# Altium project SiC780驱动.PrjPCB
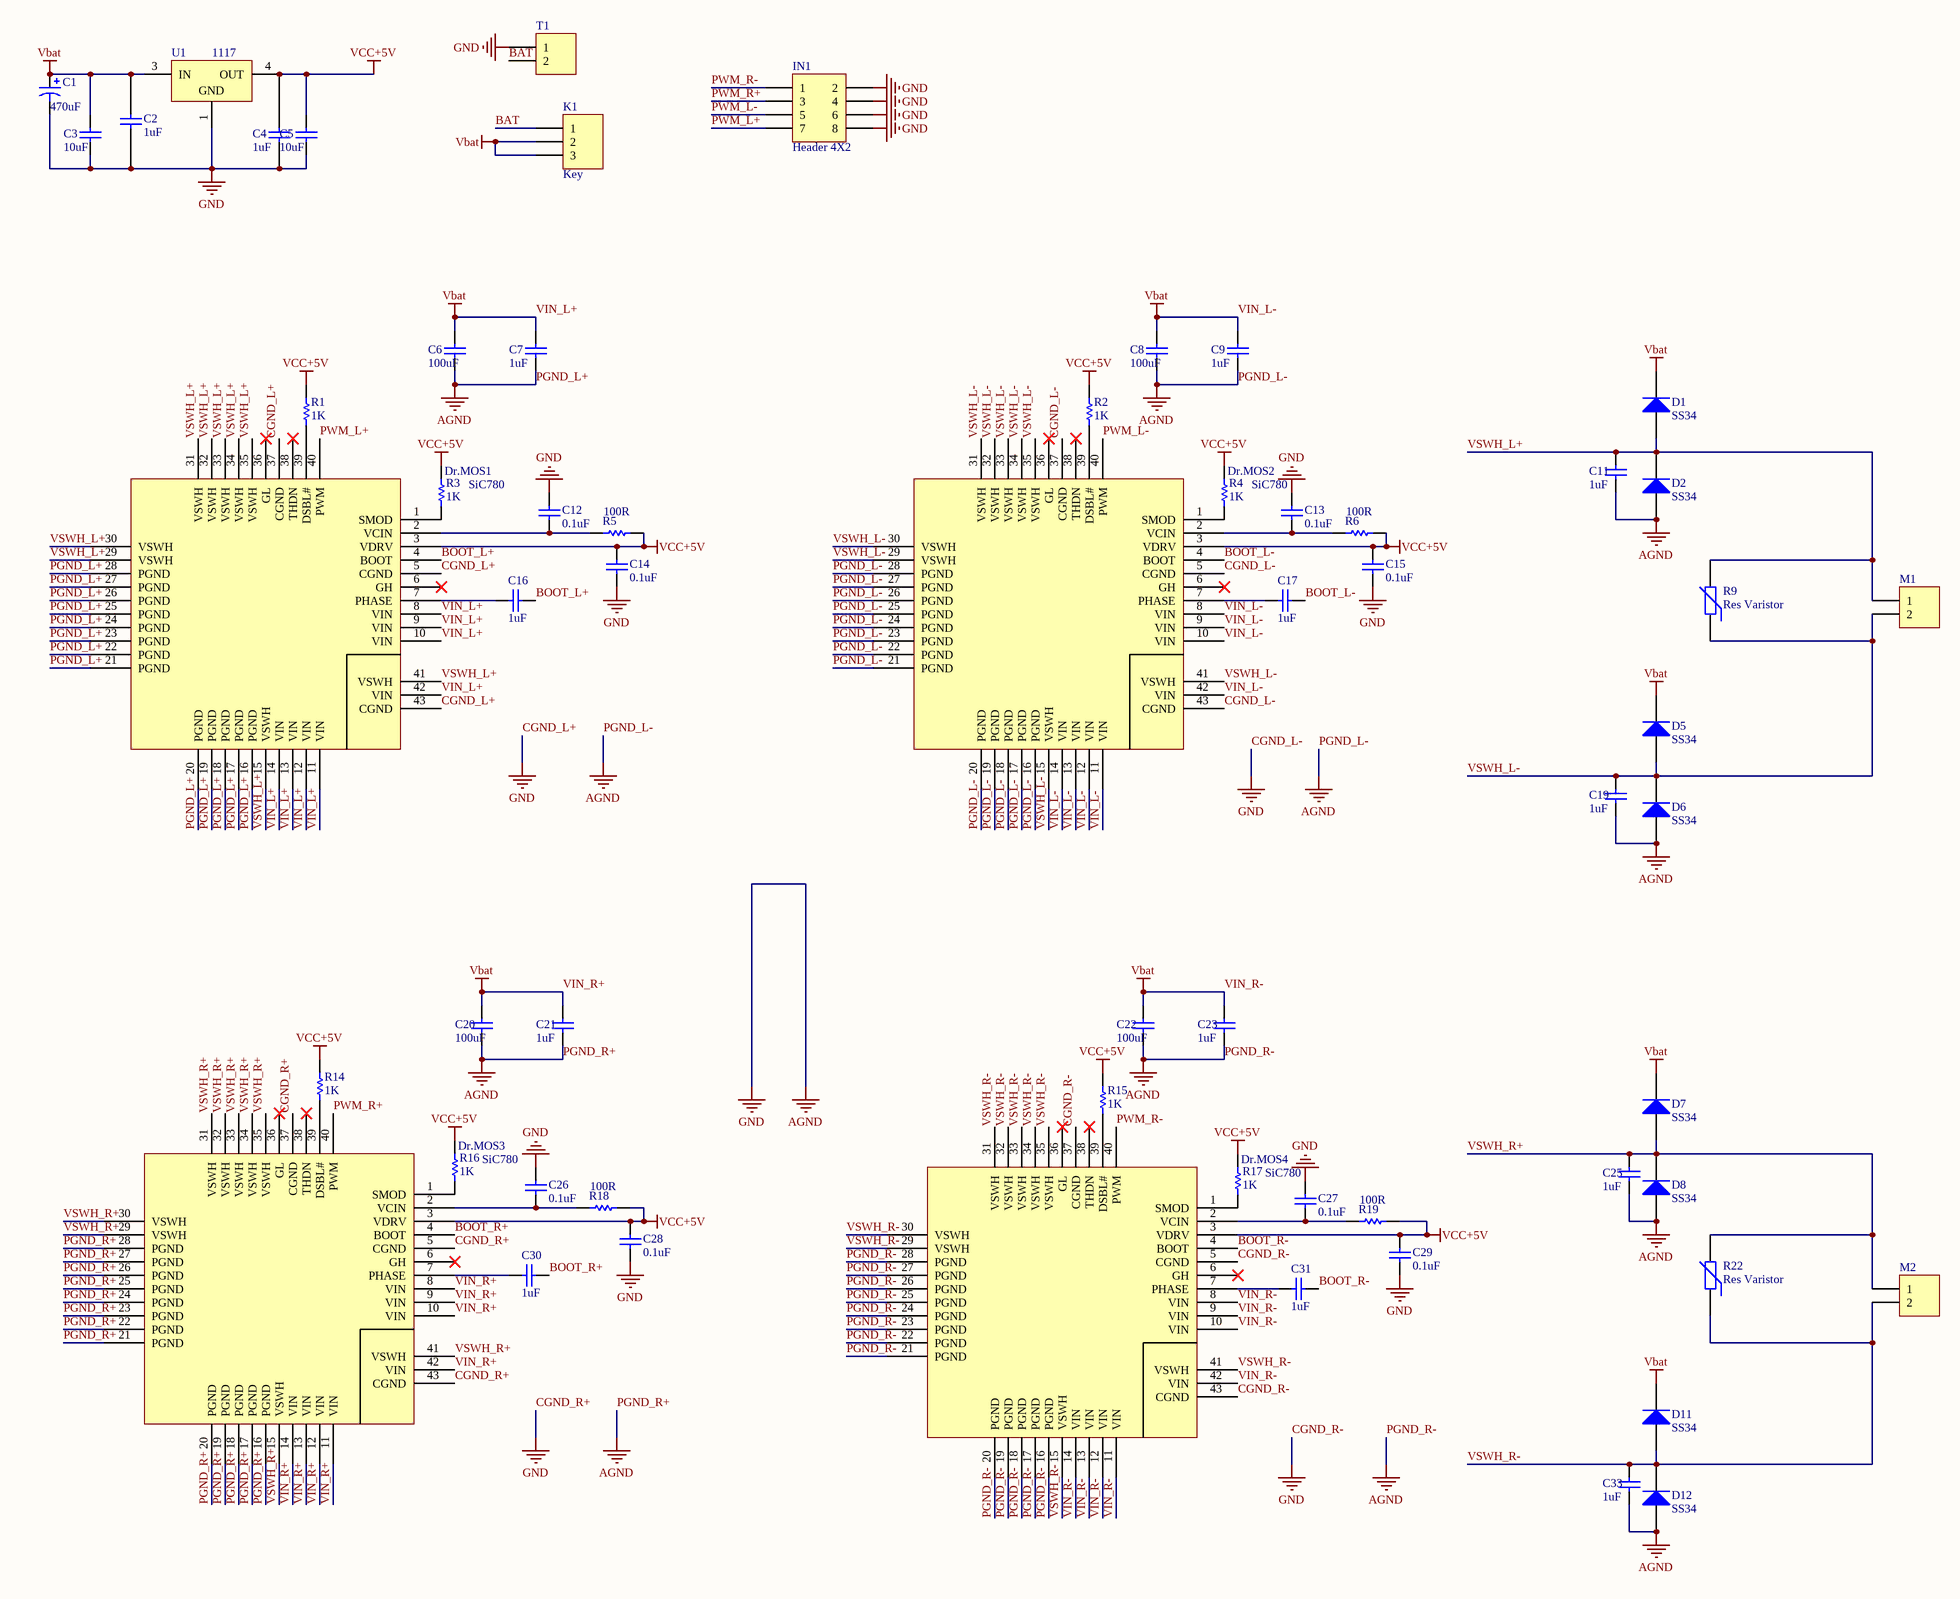
[diagram p0: SiC780驱动.SchDoc]
1 sheet, 61 parts. Net scope: global (net labels, ports and power ports of the same name join across sheets).
Board file: SiC780驱动.PcbDoc

## Sheet SiC780驱动.SchDoc
size A2; Organization: Altium Limited; Address1: L3, 12a Rodborough Rd; Address2: Frenchs Forest; Address3: NSW; Address4: Australia 2086

### Parts
C1  470uf  [CAP]
C2  1uF  [0603_C]
C3  10uF  [1206_C]
C4  1uF  [0603_C]
C5  10uF  [1206_C]
C6  100uF  [1206_C]
C7  1uF  [0603_C]
C8  100uF  [1206_C]
C9  1uF  [0603_C]
C11  1uF  [0603_C]
C12  0.1uF  [0603_C]
C13  0.1uF  [0603_C]
C14  0.1uF  [0603_C]
C15  0.1uF  [0603_C]
C16  value 1uF  [0603_C]  (hidden comment: 0.1uF)
C17  value 1uF  [0603_C]  (hidden comment: 0.1uF)
C19  1uF  [0603_C]
C20  100uF  [1206_C]
C21  1uF  [0603_C]
C22  100uF  [1206_C]
C23  1uF  [0603_C]
C25  1uF  [0603_C]
C26  0.1uF  [0603_C]
C27  0.1uF  [0603_C]
C28  0.1uF  [0603_C]
C29  0.1uF  [0603_C]
C30  value 1uF  [0603_C]  (hidden comment: 0.1uF)
C31  value 1uF  [0603_C]  (hidden comment: 0.1uF)
C33  1uF  [0603_C]
D1  SS34  [Diode-1N5189  5*1.5mm]
D2  SS34  [Diode-1N5189  5*1.5mm]
D5  SS34  [Diode-1N5189  5*1.5mm]
D6  SS34  [Diode-1N5189  5*1.5mm]
D7  SS34  [Diode-1N5189  5*1.5mm]
D8  SS34  [Diode-1N5189  5*1.5mm]
D11  SS34  [Diode-1N5189  5*1.5mm]
D12  SS34  [Diode-1N5189  5*1.5mm]
Dr.MOS1  SiC780  [SiC780_new]
Dr.MOS2  SiC780  [SiC780_new]
Dr.MOS3  SiC780  [SiC780_new]
Dr.MOS4  SiC780  [SiC780_new]
IN1  Header 4X2  [HDR2X4_3D]
K1  Key  [SW-M]
M1  (no value)  [KF301-2P]
M2  (no value)  [KF301-2P]
R1  1K  [R0603]
R2  1K  [R0603]
R3  1K  [R0603]
R4  1K  [R0603]
R5  100R  [R0603]
R6  100R  [R0603]
R9  Res Varistor  [6-0805_N]
R14  1K  [R0603]
R15  1K  [R0603]
R16  1K  [R0603]
R17  1K  [R0603]
R18  100R  [R0603]
R19  100R  [R0603]
R22  Res Varistor  [6-0805_N]
T1  (no value)  [KF301-2P]
U1  1117  [SOT223_N]

### Nets
CGND_L+: C1.2 C2.1 C3.2 C4.2 C5.2 C6.2 C7.2 C8.2 C9.2 C11.2 C12.1 C13.1 C14.1 C15.1 C19.2 C20.2 C21.2 C22.2 C23.2 C25.2 C26.1 C27.1 C28.1 C29.1 C33.2 D2.1(A) D6.1(A) D8.1(A) D12.1(A) Dr.MOS1.5(CGND) Dr.MOS1.16(PGND) Dr.MOS1.17(PGND) Dr.MOS1.18(PGND) Dr.MOS1.19(PGND) Dr.MOS1.20(PGND) Dr.MOS1.21(PGND) Dr.MOS1.22(PGND) Dr.MOS1.23(PGND) Dr.MOS1.24(PGND) Dr.MOS1.25(PGND) Dr.MOS1.26(PGND) Dr.MOS1.27(PGND) Dr.MOS1.28(PGND) Dr.MOS1.37(CGND) Dr.MOS1.43(CGND) Dr.MOS2.5(CGND) Dr.MOS2.16(PGND) Dr.MOS2.17(PGND) Dr.MOS2.18(PGND) Dr.MOS2.19(PGND) Dr.MOS2.20(PGND) Dr.MOS2.21(PGND) Dr.MOS2.22(PGND) Dr.MOS2.23(PGND) Dr.MOS2.24(PGND) Dr.MOS2.25(PGND) Dr.MOS2.26(PGND) Dr.MOS2.27(PGND) Dr.MOS2.28(PGND) Dr.MOS2.37(CGND) Dr.MOS2.43(CGND) Dr.MOS3.5(CGND) Dr.MOS3.16(PGND) Dr.MOS3.17(PGND) Dr.MOS3.18(PGND) Dr.MOS3.19(PGND) Dr.MOS3.20(PGND) Dr.MOS3.21(PGND) Dr.MOS3.22(PGND) Dr.MOS3.23(PGND) Dr.MOS3.24(PGND) Dr.MOS3.25(PGND) Dr.MOS3.26(PGND) Dr.MOS3.27(PGND) Dr.MOS3.28(PGND) Dr.MOS3.37(CGND) Dr.MOS3.43(CGND) Dr.MOS4.5(CGND) Dr.MOS4.16(PGND) Dr.MOS4.17(PGND) Dr.MOS4.18(PGND) Dr.MOS4.19(PGND) Dr.MOS4.20(PGND) Dr.MOS4.21(PGND) Dr.MOS4.22(PGND) Dr.MOS4.23(PGND) Dr.MOS4.24(PGND) Dr.MOS4.25(PGND) Dr.MOS4.26(PGND) Dr.MOS4.27(PGND) Dr.MOS4.28(PGND) Dr.MOS4.37(CGND) Dr.MOS4.43(CGND) IN1.2 IN1.4 IN1.6 IN1.8 T1.1 U1.1(GND)  [also labelled AGND, CGND_L-, CGND_R+, CGND_R-, GND, PGND_L+, PGND_L-, PGND_R+, PGND_R-]
VCC+5V: C4.1 C5.1 C14.2 C15.2 C28.2 C29.2 Dr.MOS1.3(VDRV) Dr.MOS2.3(VDRV) Dr.MOS3.3(VDRV) Dr.MOS4.3(VDRV) R1.1 R2.1 R3.1 R4.1 R5.1 R6.1 R14.1 R15.1 R16.1 R17.1 R18.1 R19.1 U1.4(OUT)
VIN_L+: C1.1 C2.2 C3.1 C6.1 C7.1 C8.1 C9.1 C20.1 C21.1 C22.1 C23.1 D1.2(K) D5.2(K) D7.2(K) D11.2(K) Dr.MOS1.8(VIN) Dr.MOS1.9(VIN) Dr.MOS1.10(VIN) Dr.MOS1.11(VIN) Dr.MOS1.12(VIN) Dr.MOS1.13(VIN) Dr.MOS1.14(VIN) Dr.MOS1.42(VIN) Dr.MOS2.8(VIN) Dr.MOS2.9(VIN) Dr.MOS2.10(VIN) Dr.MOS2.11(VIN) Dr.MOS2.12(VIN) Dr.MOS2.13(VIN) Dr.MOS2.14(VIN) Dr.MOS2.42(VIN) Dr.MOS3.8(VIN) Dr.MOS3.9(VIN) Dr.MOS3.10(VIN) Dr.MOS3.11(VIN) Dr.MOS3.12(VIN) Dr.MOS3.13(VIN) Dr.MOS3.14(VIN) Dr.MOS3.42(VIN) Dr.MOS4.8(VIN) Dr.MOS4.9(VIN) Dr.MOS4.10(VIN) Dr.MOS4.11(VIN) Dr.MOS4.12(VIN) Dr.MOS4.13(VIN) Dr.MOS4.14(VIN) Dr.MOS4.42(VIN) K1.2 K1.3 U1.3(IN)  [also labelled Vbat, VIN_L-, VIN_R+, VIN_R-]
BAT: K1.1 T1.2
BOOT_L+: C16.2 Dr.MOS1.4(BOOT)
BOOT_L-: C17.2 Dr.MOS2.4(BOOT)
BOOT_R+: C30.2 Dr.MOS3.4(BOOT)
BOOT_R-: C31.2 Dr.MOS4.4(BOOT)
PWM_L+: Dr.MOS1.40(PWM) IN1.7
PWM_L-: Dr.MOS2.40(PWM) IN1.5
PWM_R+: Dr.MOS3.40(PWM) IN1.3
PWM_R-: Dr.MOS4.40(PWM) IN1.1
VSWH_L+: C11.1 D1.1(A) D2.2(K) Dr.MOS1.15(VSWH) Dr.MOS1.29(VSWH) Dr.MOS1.30(VSWH) Dr.MOS1.31(VSWH) Dr.MOS1.32(VSWH) Dr.MOS1.33(VSWH) Dr.MOS1.34(VSWH) Dr.MOS1.35(VSWH) Dr.MOS1.41(VSWH) M1.1 R9.2
VSWH_L-: C19.1 D5.1(A) D6.2(K) Dr.MOS2.15(VSWH) Dr.MOS2.29(VSWH) Dr.MOS2.30(VSWH) Dr.MOS2.31(VSWH) Dr.MOS2.32(VSWH) Dr.MOS2.33(VSWH) Dr.MOS2.34(VSWH) Dr.MOS2.35(VSWH) Dr.MOS2.41(VSWH) M1.2 R9.1
VSWH_R+: C25.1 D7.1(A) D8.2(K) Dr.MOS3.15(VSWH) Dr.MOS3.29(VSWH) Dr.MOS3.30(VSWH) Dr.MOS3.31(VSWH) Dr.MOS3.32(VSWH) Dr.MOS3.33(VSWH) Dr.MOS3.34(VSWH) Dr.MOS3.35(VSWH) Dr.MOS3.41(VSWH) M2.1 R22.2
VSWH_R-: C33.1 D11.1(A) D12.2(K) Dr.MOS4.15(VSWH) Dr.MOS4.29(VSWH) Dr.MOS4.30(VSWH) Dr.MOS4.31(VSWH) Dr.MOS4.32(VSWH) Dr.MOS4.33(VSWH) Dr.MOS4.34(VSWH) Dr.MOS4.35(VSWH) Dr.MOS4.41(VSWH) M2.2 R22.1
NetC12_2: C12.2 Dr.MOS1.2(VCIN) R5.2
NetC13_2: C13.2 Dr.MOS2.2(VCIN) R6.2
NetC16_1: C16.1 Dr.MOS1.7(PHASE)
NetC17_1: C17.1 Dr.MOS2.7(PHASE)
NetC26_2: C26.2 Dr.MOS3.2(VCIN) R18.2
NetC27_2: C27.2 Dr.MOS4.2(VCIN) R19.2
NetC30_1: C30.1 Dr.MOS3.7(PHASE)
NetC31_1: C31.1 Dr.MOS4.7(PHASE)
NetDr.MOS1_1: Dr.MOS1.1(SMOD) R3.2
NetDr.MOS1_39: Dr.MOS1.39(DSBL#) R1.2
NetDr.MOS2_1: Dr.MOS2.1(SMOD) R4.2
NetDr.MOS2_39: Dr.MOS2.39(DSBL#) R2.2
NetDr.MOS3_1: Dr.MOS3.1(SMOD) R16.2
NetDr.MOS3_39: Dr.MOS3.39(DSBL#) R14.2
NetDr.MOS4_1: Dr.MOS4.1(SMOD) R17.2
NetDr.MOS4_39: Dr.MOS4.39(DSBL#) R15.2

Not connected (* = marked no-connect by the designer): Dr.MOS1 6(GH)* 36(GL)* 38(THDN)*; Dr.MOS2 6(GH)* 36(GL)* 38(THDN)*; Dr.MOS3 6(GH)* 36(GL)* 38(THDN)*; Dr.MOS4 6(GH)* 36(GL)* 38(THDN)*

### Notes on the sheet
- Title
- Size:
- Date:
- A3
- Number:
- Time:
- Revision:
- Sheet
- of
- File:

### Library data of the parts
C1 = Cap Pol3: Polarized Capacitor (Surface Mount); Published: 8-Jun-2000; LatestRevisionDate: 17-Jul-2002; LatestRevisionNote: Re-released for DXP Platform.; PackageReference: C0805; Publisher: Altium Limited; Value: 470uF
C2-C9 C11-C17 C19-C23 C25-C31 C33 = Cap: Capacitor; Published: 8-Jun-2000; LatestRevisionDate: 17-Jul-2002; LatestRevisionNote: Re-released for DXP Platform.; PackageReference: RAD-0.3; Publisher: Altium Limited
  C2 C4 C7 C9 C11 C19 C21 C23 C25 C33: Value: 1uF
  C3 C5: Value: 10uF
  C6 C8 C20 C22: Value: 100uF
  C12-C15 C26-C29: Value: 0.1uF
D1 D2 D5-D8 D11 D12 = Diode
IN1 = Header 4X2: Header, 4-Pin, Dual row; LatestRevisionDate: 17-Jul-2002; LatestRevisionNote: Re-released for DXP Platform.; Publisher: Altium Limited
K1 = Header 3: Header, 3-Pin; LatestRevisionDate: 17-Jul-2002; LatestRevisionNote: Re-released for DXP Platform.; Publisher: Altium Limited
M1 M2 T1 = Header 2: Header, 2-Pin; LatestRevisionDate: 17-Jul-2002; LatestRevisionNote: Re-released for DXP Platform.; Publisher: Altium Limited
R1-R6 R14-R19 = Res1: Resistor; Published: 8-Jun-2000; LatestRevisionDate: 17-Jul-2002; LatestRevisionNote: Re-released for DXP Platform.; Publisher: Altium Limited
  R1-R4 R14-R17: Value: 1K
  R5 R6 R18 R19: Value: 100R
R9 R22 = Res Varistor: Varistor (Voltage-Sensitive Resistor); Published: 24-Mar-1999; LatestRevisionDate: 29-May-2009; LatestRevisionNote: IPC-7351 Footprint Added.; PackageVersion: Mar-2003; PackageReference: 6-0805; Publisher: Altium Limited; PackageDescription: Chip Resistor 0805 Case Size; Code_IPC: RESC2012
U1 = LM1117DT-3.3: 800mA Low-Dropout Linear Regulator; pin to pad: 2>4; Manufacturer: National Semiconductor; CompType: LDO IC; PackageTopMarking: NSUZXYTT*LM1117*DT-3.3; PowerWise: N; Published: 4-Dec-2008; DatasheetVersion: Apr-2006; PackageVersion: revC, Apr-2003; PackageReference: TD03B; Publisher: Altium Limited; PackageDescription: TO252, Molded, Jedec, 6.8 x 6.10 x 2.30mm Body, 3 Lead, 2.28mm Pitch, Surface Mount; PartNumber: LM1117DT-3.3; RoHS: O; PinCount: 3; DigiKeyPartNumber: LM1117DT-3.3-ND; Code_JEDEC: TO-252-AA; ComponentLink1Description: LM1117 Datasheet; ComponentLink1URL: http://www.national.com/ds/LM/LM1117.pdf; ComponentLink2Description: LM1117 Web Page; ComponentLink2URL: http://www.national.com/pf/LM/LM1117.html; ComponentLink3Description: TD03B Package Page; ComponentLink3URL: http://www.national.com/packaging/folders/td03b.html